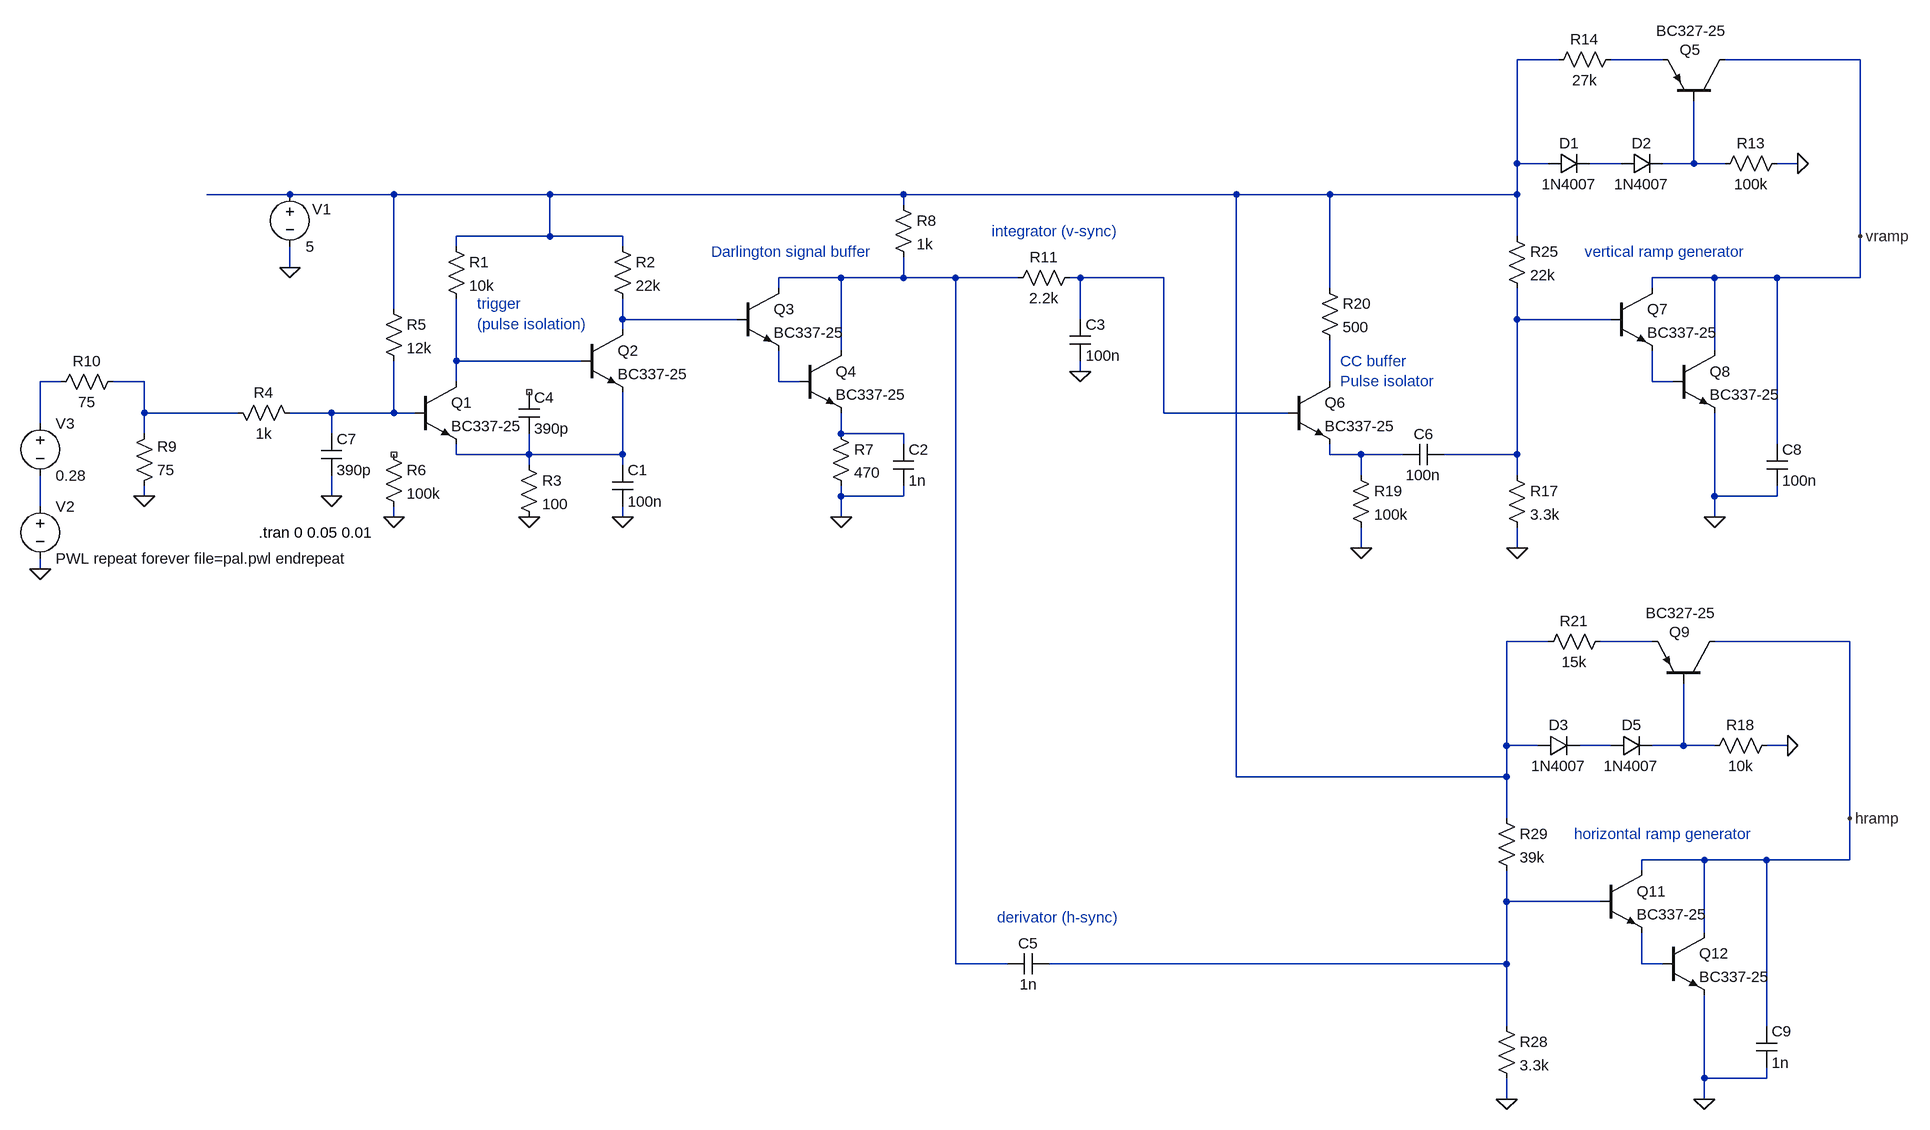
[diagram p0: schematic triggerer good.asc]
triggerer good.asc, the LTspice schematic file:
Version 4
SHEET 1 2752 2052
WIRE 2272 432 2208 432
WIRE 2432 432 2352 432
WIRE 2736 432 2528 432
WIRE 2208 592 2208 432
WIRE 2256 592 2208 592
WIRE 2368 592 2320 592
WIRE 2480 592 2480 496
WIRE 2480 592 2432 592
WIRE 2528 592 2480 592
WIRE 2640 592 2608 592
WIRE 320 640 192 640
WIRE 480 640 320 640
WIRE 720 640 480 640
WIRE 1264 640 720 640
WIRE 1776 640 1264 640
WIRE 1920 640 1776 640
WIRE 2208 640 2208 592
WIRE 2208 640 1920 640
WIRE 1264 656 1264 640
WIRE 720 704 720 640
WIRE 720 704 576 704
WIRE 832 704 720 704
WIRE 2208 704 2208 640
WIRE 2736 704 2736 432
WIRE 576 720 576 704
WIRE 832 720 832 704
WIRE 320 752 320 720
WIRE 1168 768 1072 768
WIRE 1264 768 1264 736
WIRE 1264 768 1168 768
WIRE 1344 768 1264 768
WIRE 1440 768 1344 768
WIRE 1536 768 1520 768
WIRE 1664 768 1536 768
WIRE 2512 768 2416 768
WIRE 2608 768 2512 768
WIRE 2736 768 2736 704
WIRE 2736 768 2608 768
WIRE 1072 784 1072 768
WIRE 1920 784 1920 640
WIRE 2416 784 2416 768
WIRE 480 816 480 640
WIRE 832 832 832 800
WIRE 1008 832 832 832
WIRE 1536 832 1536 768
WIRE 2208 832 2208 784
WIRE 2352 832 2208 832
WIRE 832 848 832 832
WIRE 1168 880 1168 768
WIRE 2512 880 2512 768
WIRE 576 896 576 800
WIRE 768 896 576 896
WIRE 1536 912 1536 896
WIRE -32 928 -64 928
WIRE 96 928 48 928
WIRE 576 928 576 896
WIRE 1072 928 1072 880
WIRE 1104 928 1072 928
WIRE 1920 928 1920 864
WIRE 2416 928 2416 880
WIRE 2448 928 2416 928
WIRE 96 976 96 928
WIRE 240 976 96 976
WIRE 384 976 320 976
WIRE 480 976 480 896
WIRE 480 976 384 976
WIRE 512 976 480 976
WIRE 1664 976 1664 768
WIRE 1856 976 1664 976
WIRE -64 992 -64 928
WIRE 96 1008 96 976
WIRE 384 1008 384 976
WIRE 1168 1008 1168 976
WIRE 1264 1008 1168 1008
WIRE 1264 1024 1264 1008
WIRE 2608 1024 2608 768
WIRE 576 1040 576 1024
WIRE 688 1040 688 1008
WIRE 688 1040 576 1040
WIRE 832 1040 832 944
WIRE 832 1040 688 1040
WIRE 1920 1040 1920 1024
WIRE 1968 1040 1920 1040
WIRE 2032 1040 1968 1040
WIRE 2208 1040 2208 832
WIRE 2208 1040 2096 1040
WIRE 688 1056 688 1040
WIRE 832 1056 832 1040
WIRE 1968 1072 1968 1040
WIRE 2208 1072 2208 1040
WIRE 96 1104 96 1088
WIRE 384 1104 384 1072
WIRE 1168 1104 1168 1088
WIRE 1264 1104 1264 1088
WIRE 1264 1104 1168 1104
WIRE 2512 1104 2512 976
WIRE 2608 1104 2608 1088
WIRE 2608 1104 2512 1104
WIRE -64 1120 -64 1072
WIRE 480 1136 480 1120
WIRE 832 1136 832 1120
WIRE 1168 1136 1168 1104
WIRE 2512 1136 2512 1104
WIRE 1968 1184 1968 1152
WIRE 2208 1184 2208 1152
WIRE -64 1216 -64 1200
WIRE 2256 1328 2192 1328
WIRE 2416 1328 2336 1328
WIRE 2720 1328 2512 1328
WIRE 2192 1488 2192 1328
WIRE 2240 1488 2192 1488
WIRE 2352 1488 2304 1488
WIRE 2464 1488 2464 1392
WIRE 2464 1488 2416 1488
WIRE 2512 1488 2464 1488
WIRE 2624 1488 2592 1488
WIRE 1776 1536 1776 640
WIRE 2192 1536 2192 1488
WIRE 2192 1536 1776 1536
WIRE 2192 1600 2192 1536
WIRE 2720 1600 2720 1328
WIRE 2496 1664 2400 1664
WIRE 2592 1664 2496 1664
WIRE 2720 1664 2720 1600
WIRE 2720 1664 2592 1664
WIRE 2400 1680 2400 1664
WIRE 2192 1728 2192 1680
WIRE 2336 1728 2192 1728
WIRE 2496 1776 2496 1664
WIRE 1344 1824 1344 768
WIRE 1424 1824 1344 1824
WIRE 2192 1824 2192 1728
WIRE 2192 1824 1488 1824
WIRE 2400 1824 2400 1776
WIRE 2432 1824 2400 1824
WIRE 2192 1920 2192 1824
WIRE 2592 1920 2592 1664
WIRE 2496 2000 2496 1872
WIRE 2592 2000 2592 1984
WIRE 2592 2000 2496 2000
WIRE 2192 2032 2192 2000
WIRE 2496 2032 2496 2000
FLAG 688 1136 0
FLAG -64 1216 0
FLAG 320 752 0
FLAG 480 1136 0
FLAG 832 1136 0
FLAG 1168 1136 0
FLAG 1536 912 0
FLAG 2640 592 0
FLAG 1968 1184 0
FLAG 2512 1136 0
FLAG 2208 1184 0
FLAG 2736 704 vramp
FLAG 2624 1488 0
FLAG 2496 2032 0
FLAG 2192 2032 0
FLAG 2720 1600 hramp
FLAG 96 1104 0
FLAG 384 1104 0
SYMBOL npn 512 928 R0
SYMATTR InstName Q1
SYMATTR Value BC337-25
SYMBOL npn 768 848 R0
SYMATTR InstName Q2
SYMATTR Value BC337-25
SYMBOL res 560 704 R0
SYMATTR InstName R1
SYMATTR Value 10k
SYMBOL res 816 704 R0
SYMATTR InstName R2
SYMATTR Value 22k
SYMBOL res 672 1040 R0
SYMATTR InstName R3
SYMATTR Value 100
SYMBOL res 224 960 M90
WINDOW 0 0 56 VBottom 2
WINDOW 3 32 56 VTop 2
SYMATTR InstName R4
SYMATTR Value 1k
SYMBOL voltage 320 624 R0
WINDOW 123 0 0 Left 0
WINDOW 39 0 0 Left 0
WINDOW 0 34 38 Left 2
SYMATTR InstName V1
SYMATTR Value 5
SYMBOL voltage -64 1104 R0
WINDOW 123 0 0 Left 0
WINDOW 39 0 0 Left 0
SYMATTR InstName V2
SYMATTR Value PWL repeat forever file=pal.pwl endrepeat
SYMBOL res 464 1024 R0
SYMATTR InstName R6
SYMATTR Value 100k
SYMBOL res 464 800 R0
SYMATTR InstName R5
SYMATTR Value 12k
SYMBOL cap 816 1056 R0
SYMATTR InstName C1
SYMATTR Value 100n
SYMBOL npn 1008 784 R0
SYMATTR InstName Q3
SYMATTR Value BC337-25
SYMBOL res 1152 992 R0
SYMATTR InstName R7
SYMATTR Value 470
SYMBOL npn 1104 880 R0
SYMATTR InstName Q4
SYMATTR Value BC337-25
SYMBOL res 1248 640 R0
SYMATTR InstName R8
SYMATTR Value 1k
SYMBOL cap 1248 1024 R0
SYMATTR InstName C2
SYMATTR Value 1n
SYMBOL cap 672 944 R0
SYMATTR InstName C4
SYMATTR Value 390p
SYMBOL res 1536 752 R90
WINDOW 0 0 56 VBottom 2
WINDOW 3 32 56 VTop 2
SYMATTR InstName R11
SYMATTR Value 2.2k
SYMBOL cap 1520 832 R0
SYMATTR InstName C3
SYMATTR Value 100n
SYMBOL cap 1488 1808 R90
WINDOW 0 0 32 VBottom 2
WINDOW 3 32 32 VTop 2
SYMATTR InstName C5
SYMATTR Value 1n
SYMBOL diode 2256 608 R270
WINDOW 0 32 32 VTop 2
WINDOW 3 0 32 VBottom 2
SYMATTR InstName D1
SYMATTR Value 1N4007
SYMBOL diode 2368 608 R270
WINDOW 0 32 32 VTop 2
WINDOW 3 0 32 VBottom 2
SYMATTR InstName D2
SYMATTR Value 1N4007
SYMBOL pnp 2528 496 M270
WINDOW 0 79 70 VLeft 2
WINDOW 3 108 106 VLeft 2
SYMATTR InstName Q5
SYMATTR Value BC327-25
SYMBOL res 2512 608 R270
WINDOW 0 32 56 VTop 2
WINDOW 3 0 56 VBottom 2
SYMATTR InstName R13
SYMATTR Value 100k
SYMBOL res 2256 448 R270
WINDOW 0 32 56 VTop 2
WINDOW 3 0 56 VBottom 2
SYMATTR InstName R14
SYMATTR Value 27k
SYMBOL npn 1856 928 R0
SYMATTR InstName Q6
SYMATTR Value BC337-25
SYMBOL res 1952 1056 R0
SYMATTR InstName R19
SYMATTR Value 100k
SYMBOL res 1904 768 R0
SYMATTR InstName R20
SYMATTR Value 500
SYMBOL cap 2096 1024 R90
WINDOW 0 0 32 VBottom 2
WINDOW 3 32 32 VTop 2
SYMATTR InstName C6
SYMATTR Value 100n
SYMBOL npn 2352 784 R0
SYMATTR InstName Q7
SYMATTR Value BC337-25
SYMBOL npn 2448 880 R0
SYMATTR InstName Q8
SYMATTR Value BC337-25
SYMBOL cap 2592 1024 R0
SYMATTR InstName C8
SYMATTR Value 100n
SYMBOL res 2192 1056 R0
SYMATTR InstName R17
SYMATTR Value 3.3k
SYMBOL res 2192 688 R0
SYMATTR InstName R25
SYMATTR Value 22k
SYMBOL diode 2240 1504 R270
WINDOW 0 32 32 VTop 2
WINDOW 3 0 32 VBottom 2
SYMATTR InstName D3
SYMATTR Value 1N4007
SYMBOL pnp 2512 1392 M270
WINDOW 0 79 70 VLeft 2
WINDOW 3 108 106 VLeft 2
SYMATTR InstName Q9
SYMATTR Value BC327-25
SYMBOL res 2496 1504 R270
WINDOW 0 32 56 VTop 2
WINDOW 3 0 56 VBottom 2
SYMATTR InstName R18
SYMATTR Value 10k
SYMBOL res 2240 1344 R270
WINDOW 0 32 56 VTop 2
WINDOW 3 0 56 VBottom 2
SYMATTR InstName R21
SYMATTR Value 15k
SYMBOL npn 2336 1680 R0
SYMATTR InstName Q11
SYMATTR Value BC337-25
SYMBOL npn 2432 1776 R0
SYMATTR InstName Q12
SYMATTR Value BC337-25
SYMBOL cap 2576 1920 R0
SYMATTR InstName C9
SYMATTR Value 1n
SYMBOL res 2176 1904 R0
SYMATTR InstName R28
SYMATTR Value 3.3k
SYMBOL res 2176 1584 R0
SYMATTR InstName R29
SYMATTR Value 39k
SYMBOL diode 2352 1504 R270
WINDOW 0 32 32 VTop 2
WINDOW 3 0 32 VBottom 2
SYMATTR InstName D5
SYMATTR Value 1N4007
SYMBOL res 80 1104 M180
WINDOW 0 36 76 Left 2
WINDOW 3 36 40 Left 2
SYMATTR InstName R9
SYMATTR Value 75
SYMBOL cap 368 1008 R0
SYMATTR InstName C7
SYMATTR Value 390p
SYMBOL voltage -64 976 R0
SYMATTR InstName V3
SYMATTR Value 0.28
SYMBOL res 64 912 R90
WINDOW 0 0 56 VBottom 2
WINDOW 3 32 56 VTop 2
SYMATTR InstName R10
SYMATTR Value 75
TEXT 272 1160 Left 2 !.tran 0 0.05 0.01
TEXT 608 808 Left 2 ;trigger\n(pulse isolation)
TEXT 968 728 Left 2 ;Darlington signal buffer
TEXT 1400 696 Left 2 ;integrator (v-sync)
TEXT 1408 1752 Left 2 ;derivator (h-sync)
TEXT 2312 728 Left 2 ;vertical ramp generator
TEXT 1936 896 Left 2 ;CC buffer\nPulse isolator
TEXT 2296 1624 Left 2 ;horizontal ramp generator

The netlist it stands for:
* triggerer good.asc
Q1 N009 N015 N017 0 BC337-25
Q2 N007 N009 N017 0 BC337-25
R1 N001 N009 10k
R2 N001 N007 22k
R3 N017 0 100
R4 N011 N015 1k
V1 N001 0 5
V2 N019 0 PWL repeat forever file=pal.pwl endrepeat
R6 NC_01 0 100k
R5 N001 N015 12k
C1 N017 0 100n
Q3 N005 N007 N012 0 BC337-25
R7 N016 0 470
Q4 N005 N012 N016 0 BC337-25
R8 N001 N005 1k
C2 N016 0 1n
C4 NC_02 N017 390p
R11 N006 N005 2.2k
C3 N006 0 100n
C5 N023 N005 1n
D1 N001 N003 1N4007
D2 N003 N004 1N4007
Q5 vramp N004 N002 0 BC327-25
R13 N004 0 100k
R14 N001 N002 27k
Q6 N013 N006 N018 0 BC337-25
R19 N018 0 100k
R20 N001 N013 500
C6 N008 N018 100n
Q7 vramp N008 N014 0 BC337-25
Q8 vramp N014 0 0 BC337-25
C8 vramp 0 100n
R17 N008 0 3.3k
R25 N001 N008 22k
D3 N001 N021 1N4007
Q9 hramp N022 N020 0 BC327-25
R18 N022 0 10k
R21 N001 N020 15k
Q11 hramp N023 N024 0 BC337-25
Q12 hramp N024 0 0 BC337-25
C9 hramp 0 1n
R28 N023 0 3.3k
R29 N001 N023 39k
D5 N021 N022 1N4007
R9 0 N011 75
C7 N015 0 390p
V3 N010 N019 0.28
R10 N011 N010 75
.model D D
.lib standard.dio
.model NPN NPN
.model PNP PNP
.lib standard.bjt
.tran 0 0.05 0.01
* trigger
* (pulse isolation)
* Darlington signal buffer
* integrator (v-sync)
* derivator (h-sync)
* vertical ramp generator
* CC buffer
* Pulse isolator
* horizontal ramp generator
.backanno
.end